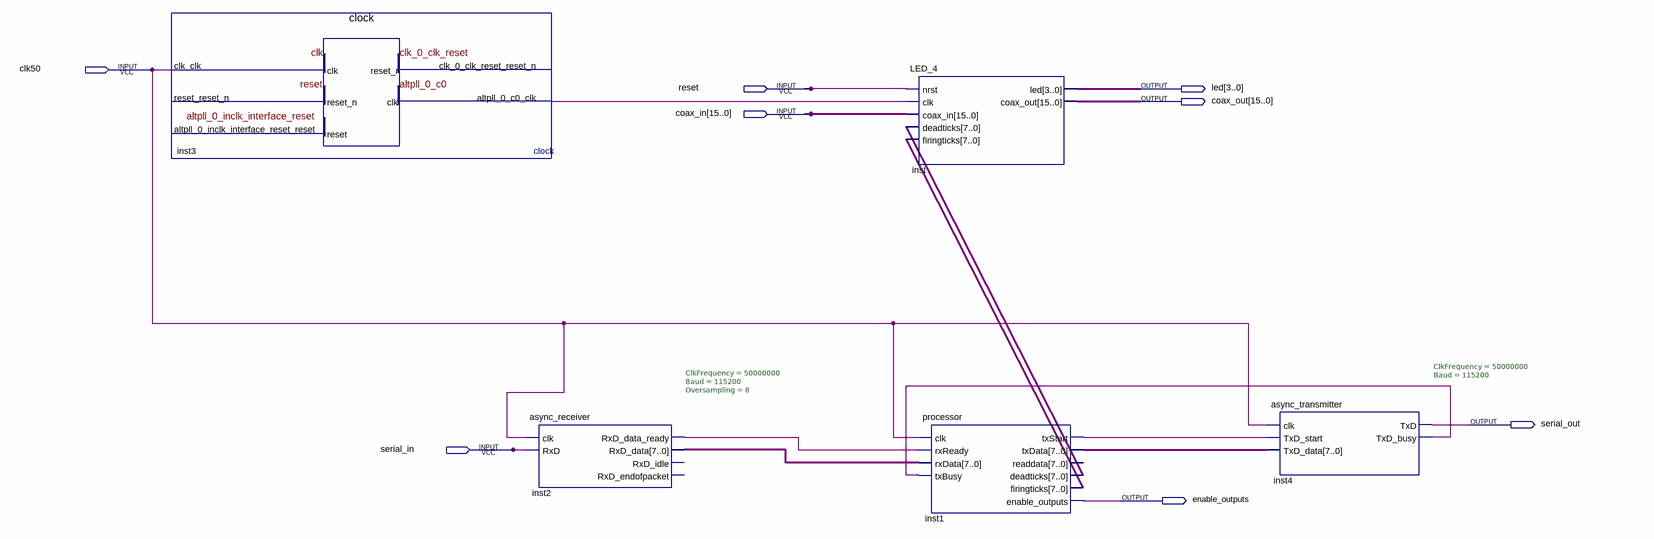
[diagram p0: schematic sheet]
// Quartus schematic coincidence.bdf as structural Verilog: 5 symbols, 8 pins
module coincidence (
  input  clk50,
  input  reset,
  input  [15:0] coax_in,
  input  serial_in,
  output [3:0] led,
  output [15:0] coax_out,
  output serial_out,
  output enable_outputs
);

  wire inst1_txstart, inst2_rxd_data_ready, inst3_altpll_0_c0_clk, inst4_txd_busy;
  wire [7:0] inst1_deadticks, inst1_firingticks, inst1_txdata, inst2_rxd_data;

  clock inst3 (
    .clk_clk(clk50), .altpll_0_c0_clk(inst3_altpll_0_c0_clk));  // open: reset_reset_n, altpll_0_inclk_interface_reset_reset, clk_0_clk_reset_reset_n
  async_receiver #(.ClkFrequency(50000000), .Baud(115200), .Oversampling(8)) inst2 (
    .clk(clk50), .RxD(serial_in), .RxD_data_ready(inst2_rxd_data_ready), .RxD_data(inst2_rxd_data));  // open: RxD_idle, RxD_endofpacket
  LED_4 inst (
    .nrst(reset), .clk(inst3_altpll_0_c0_clk), .coax_in(coax_in), .deadticks(inst1_deadticks),
    .firingticks(inst1_firingticks), .coax_out(coax_out), .led(led));
  processor inst1 (
    .clk(clk50), .rxReady(inst2_rxd_data_ready), .rxData(inst2_rxd_data), .txBusy(inst4_txd_busy),
    .txStart(inst1_txstart), .txData(inst1_txdata), .deadticks(inst1_deadticks),
    .firingticks(inst1_firingticks), .enable_outputs(enable_outputs));  // open: readdata
  async_transmitter #(.ClkFrequency(50000000), .Baud(115200)) inst4 (
    .clk(clk50), .TxD_start(inst1_txstart), .TxD_data(inst1_txdata), .TxD(serial_out),
    .TxD_busy(inst4_txd_busy));
endmodule
